# EAGLE schematic BMS_adapter (EAGLE 9.1.3)
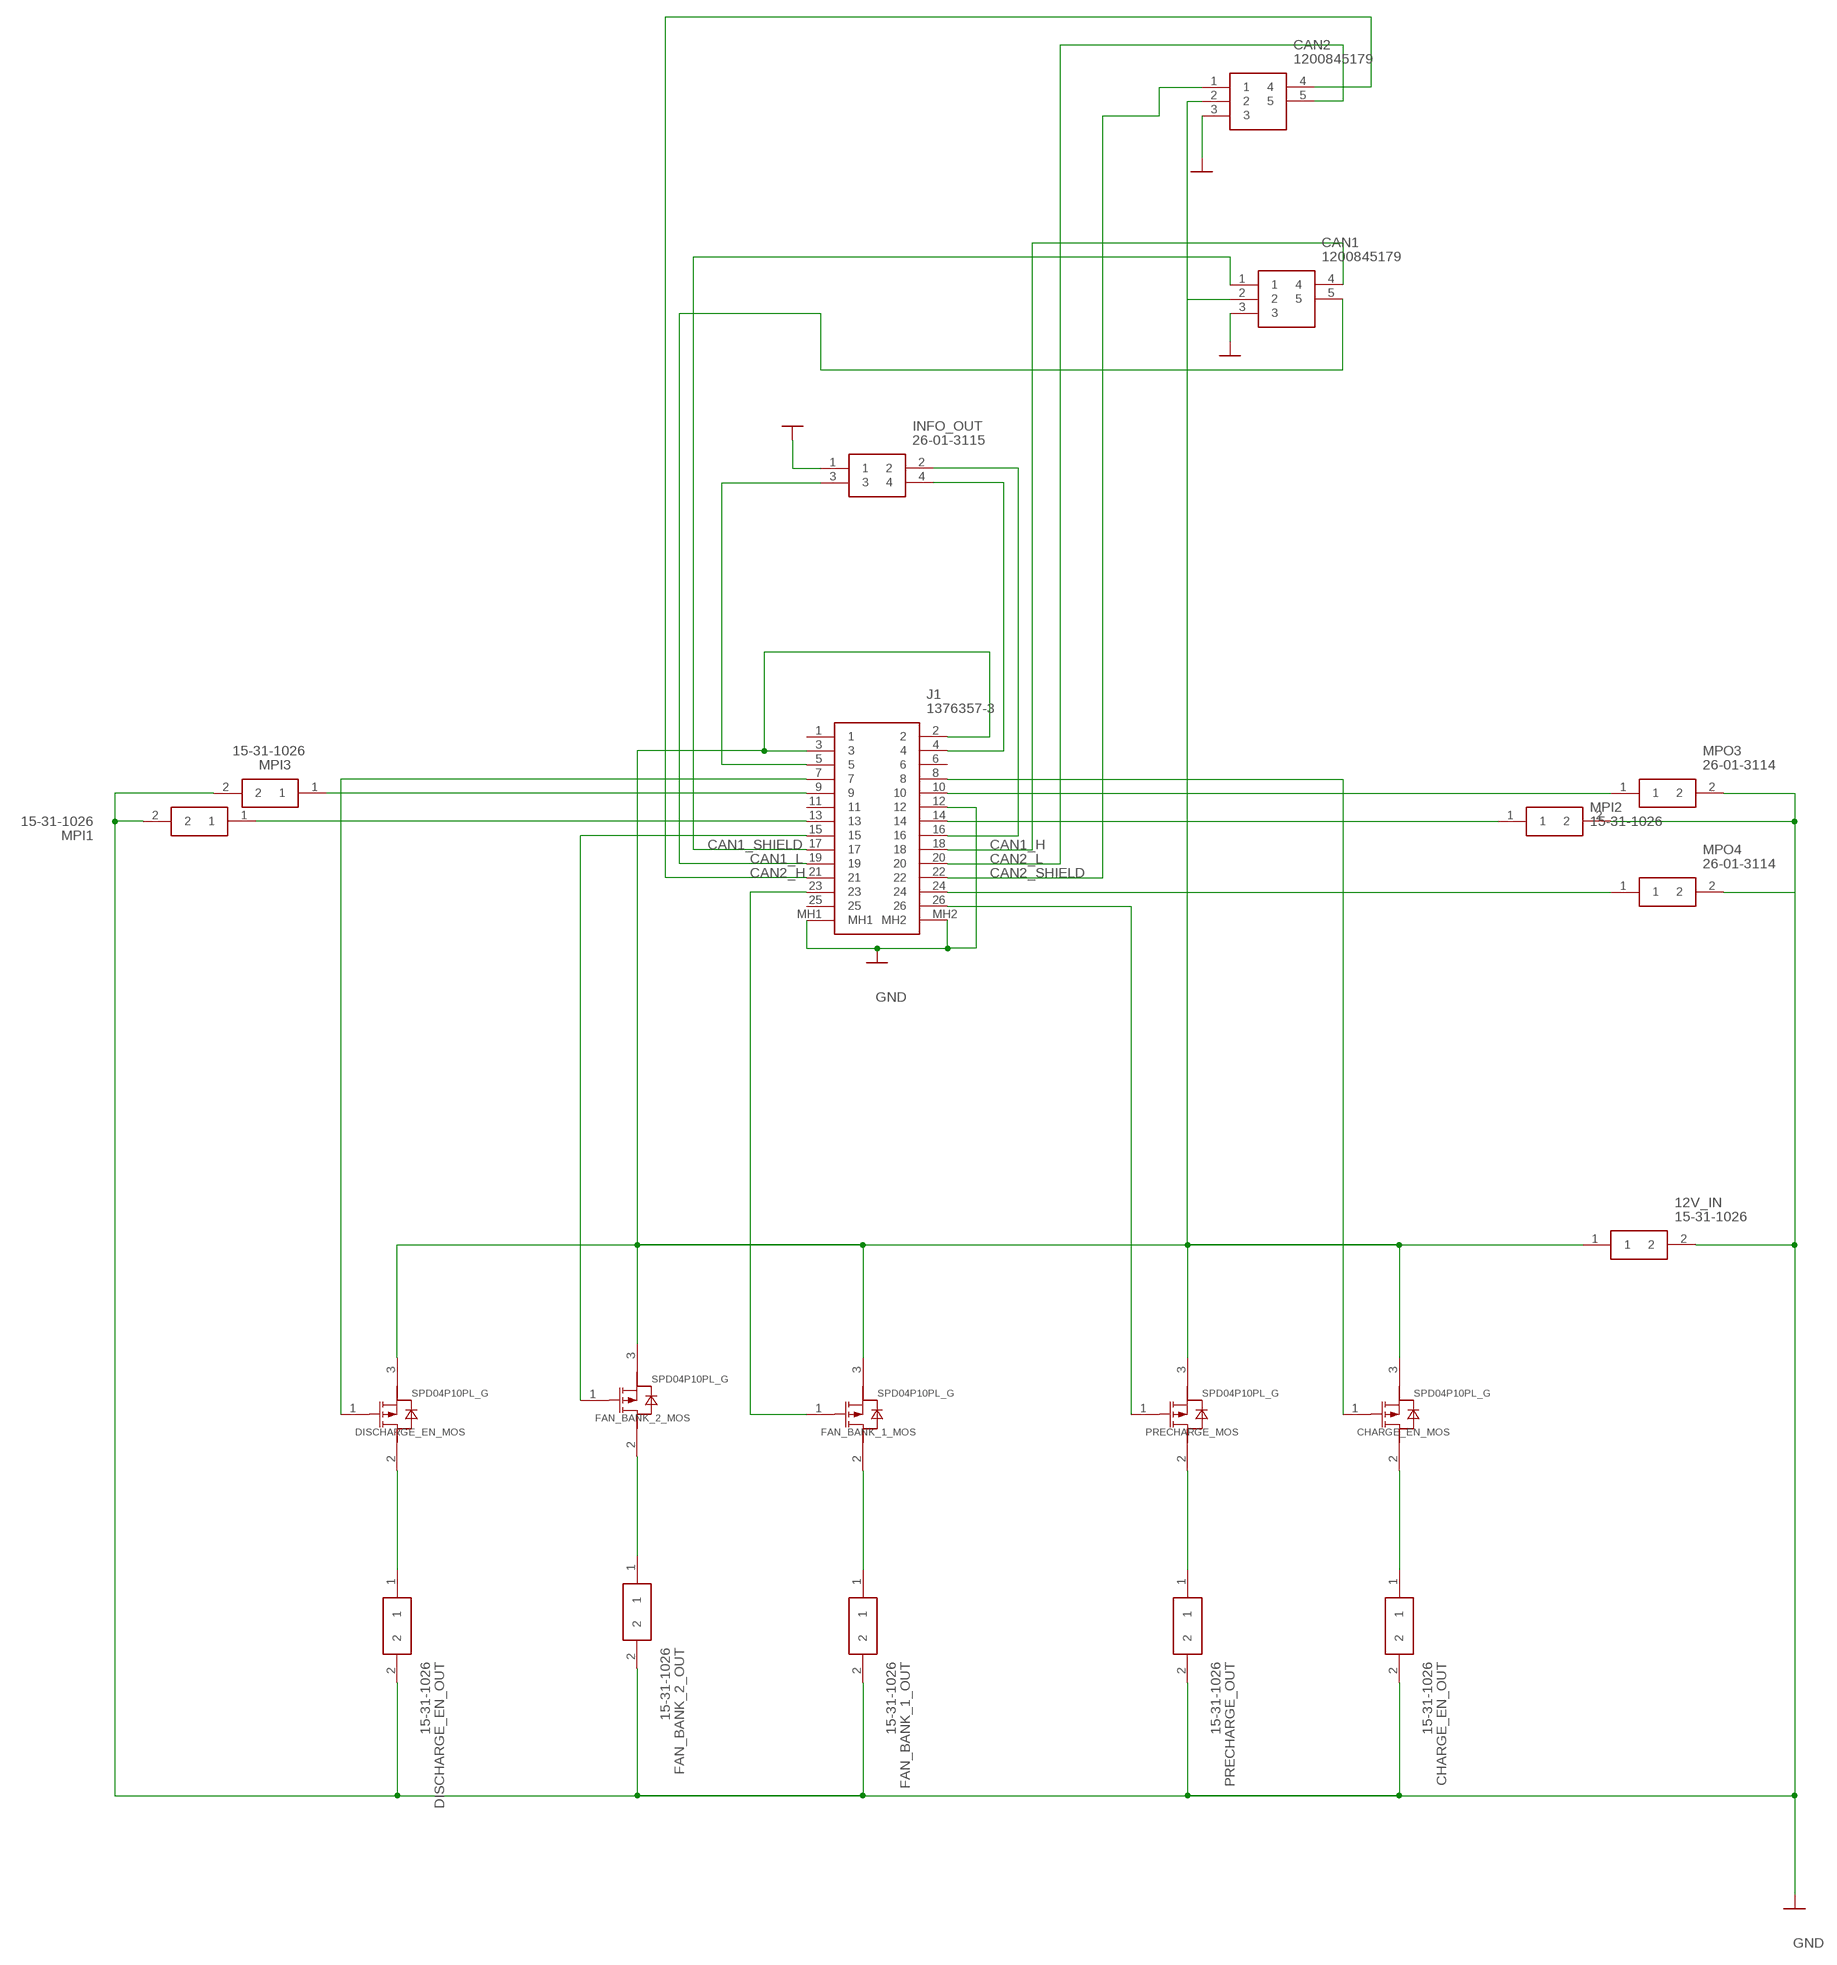
[diagram p0: schematic, sheet 1]

## Parts
12V_IN  15-31-1026  [15311026]
CAN1  1200845179  [1200845179]
CAN2  1200845179  [1200845179]
CHARGE_EN_MOS  SPD04P10PL_G  [TO229P994X241-3N]
CHARGE_EN_OUT  15-31-1026  [15311026]
DISCHARGE_EN_MOS  SPD04P10PL_G  [TO229P994X241-3N]
DISCHARGE_EN_OUT  15-31-1026  [15311026]
FAN_BANK_1_MOS  SPD04P10PL_G  [TO229P994X241-3N]
FAN_BANK_1_OUT  15-31-1026  [15311026]
FAN_BANK_2_MOS  SPD04P10PL_G  [TO229P994X241-3N]
FAN_BANK_2_OUT  15-31-1026  [15311026]
INFO_OUT  26-01-3115  [39-30-1040]
J1  1376357-3  [13763573]
MPI1  15-31-1026  [15311026]
MPI2  15-31-1026  [15311026]
MPI3  15-31-1026  [15311026]
MPO3  26-01-3114  [0026013114]
MPO4  26-01-3114  [0026013114]
PRECHARGE_MOS  SPD04P10PL_G  [TO229P994X241-3N]
PRECHARGE_OUT  15-31-1026  [15311026]

## Nets
12V: 12V_IN.1 CAN1.2 CAN2.2 CHARGE_EN_MOS.3 DISCHARGE_EN_MOS.3 FAN_BANK_1_MOS.3 FAN_BANK_2_MOS.3 J1.2 J1.3 PRECHARGE_MOS.3
CAN1_H: CAN1.4 J1.18
CAN1_L: CAN1.5 J1.19
CAN1_SHIELD: CAN1.1 J1.17
CAN2_H: CAN2.4 J1.21
CAN2_L: CAN2.5 J1.20
CAN2_SHIELD: CAN2.1 J1.22
GND: 12V_IN.2 CAN1.3 CAN2.3 CHARGE_EN_OUT.2 DISCHARGE_EN_OUT.2 FAN_BANK_1_OUT.2 FAN_BANK_2_OUT.2 INFO_OUT.1 J1.12 J1.MH1 J1.MH2 MPI1.2 MPI2.2 MPI3.2 MPO3.2 PRECHARGE_OUT.2
GND1: MPO4.2
N$1: J1.26 PRECHARGE_MOS.1
N$2: FAN_BANK_1_MOS.1 J1.23
N$3: FAN_BANK_2_MOS.1 J1.15
N$4: DISCHARGE_EN_MOS.1 J1.7
N$6: J1.10 MPO3.1
N$7: J1.9 MPI3.1
N$8: J1.13 MPI1.1
N$9: J1.14 MPI2.1
N$10: J1.24 MPO4.1
N$11: INFO_OUT.3 J1.5
N$12: INFO_OUT.4 J1.4
N$13: INFO_OUT.2 J1.16
N$14: FAN_BANK_1_MOS.2 FAN_BANK_1_OUT.1
N$23: DISCHARGE_EN_MOS.2 DISCHARGE_EN_OUT.1
N$25: CHARGE_EN_MOS.1 J1.8
N$26: FAN_BANK_2_MOS.2 FAN_BANK_2_OUT.1
N$28: CHARGE_EN_MOS.2 CHARGE_EN_OUT.1
N$30: PRECHARGE_MOS.2 PRECHARGE_OUT.1
Unconnected: J1.1 J1.6 J1.11 J1.25

## Library data of the parts
12V_IN CHARGE_EN_OUT DISCHARGE_EN_OUT FAN_BANK_1_OUT FAN_BANK_2_OUT MPI1-MPI3 PRECHARGE_OUT = 15-31-1026:15-31-1026: Molex STANDARD .093 Series, Series Number 5025, 6.7mm Pitch 2 Way 1 Row Straight PCB Header, Solder Termination, 12A Source: Datasheet <https://www.molex.com/molex/products/datasheet.jsp?part=active/0015311026_PCB_HEADERS.xml>; DESCRIPTION: Molex STANDARD .093 Series, Series Number 5025, 6.7mm Pitch 2 Way 1 Row Straight PCB Header, Solder Termination, 12A; HEIGHT: 15mm; MANUFACTURER_NAME: Molex; MANUFACTURER_PART_NUMBER: 15-31-1026; MOUSER_PART_NUMBER: 538-15-31-1026; MOUSER_PRICE-STOCK: https://www.mouser.com/Search/Refine.aspx?Keyword=538-15-31-1026; RS_PART_NUMBER: 6700289; RS_PRICE-STOCK: https://uk.rs-online.com/web/p/products/6700289
CAN1 CAN2 = SamacSys_Parts:1200845179: REC U12 5P AC FE M16 BM SOL SHD Source: Datasheet <https://componentsearchengine.com/Datasheets/1/1200845179.pdf>; DESCRIPTION: REC U12 5P AC FE M16 BM SOL SHD; HEIGHT: 24.8mm; MANUFACTURER_NAME: Molex; MANUFACTURER_PART_NUMBER: 1200845179; MOUSER_PART_NUMBER: 538-1200845179; MOUSER_PRICE-STOCK: https://www.mouser.com/Search/Refine.aspx?Keyword=538-1200845179
CHARGE_EN_MOS DISCHARGE_EN_MOS FAN_BANK_1_MOS FAN_BANK_2_MOS PRECHARGE_MOS = SPD04P10PL G:SPD04P10PL_G: SPD04P10PL G SIPMOS Power-Transistor -100V TO229P994X241-3N
INFO_OUT = SamacSys_Parts:26-01-3115: Headers & Wire Housings 4P MINIFIT JR RA DR /PEGS 15AU V2 Source: Datasheet <https://www.molex.com/pdm_docs/sd/026013115_sd.pdf>; ALLIED_NUMBER: E5291951; ALLIED_PRICE-STOCK: https://www.alliedelec.com/molex-incorporated-26-01-3115/E5291951/; DESCRIPTION: Headers & Wire Housings 4P MINIFIT JR RA DR /PEGS 15AU V2; HEIGHT: mm; MANUFACTURER_NAME: Molex; MANUFACTURER_PART_NUMBER: 26-01-3115; MOUSER_PART_NUMBER: 538-26-01-3115; MOUSER_PRICE-STOCK: https://www.mouser.com/Search/Refine.aspx?Keyword=538-26-01-3115
J1 = SamacSys_Parts:1376357-3: Automotive Connectors 025/090 CAP HSG 26P Source: Datasheet <https://www.te.com/commerce/DocumentDelivery/DDEController?Action=showdoc&DocId=Customer Drawing1376357A4pdfJapaneseJPN_CD_1376357_A4.pdf1376357-3>; ALLIED_NUMBER: 70283837; ALLIED_PRICE-STOCK: https://www.alliedelec.com/teconnectivity-1376357-3/70283837/; DESCRIPTION: Automotive Connectors 025/090 CAP HSG 26P; HEIGHT: 18.1mm; MANUFACTURER_NAME: TE Connectivity; MANUFACTURER_PART_NUMBER: 1376357-3; MOUSER_PART_NUMBER: 571-1376357-3; MOUSER_PRICE-STOCK: https://www.mouser.com/Search/Refine.aspx?Keyword=571-1376357-3
MPO3 MPO4 = SamacSys_Parts:26-01-3114: MiniFit Jr RA DR /Pegs 15Au V2 2Ckt Tray Source: Datasheet <http://www.molex.com/webdocs/datasheets/pdf/en-us//0026013114_PCB_HEADERS.pdf>; DESCRIPTION: MiniFit Jr RA DR /Pegs 15Au V2 2Ckt Tray; HEIGHT: 9mm; MANUFACTURER_NAME: Molex; MANUFACTURER_PART_NUMBER: 26-01-3114; MOUSER_PART_NUMBER: 538-26-01-3114; MOUSER_PRICE-STOCK: https://www.mouser.com/Search/Refine.aspx?Keyword=538-26-01-3114; RS_PART_NUMBER: 1791870P; RS_PRICE-STOCK: http://uk.rs-online.com/web/p/products/1791870P